# EAGLE design frontpanelboard (EAGLE 7.5.0)
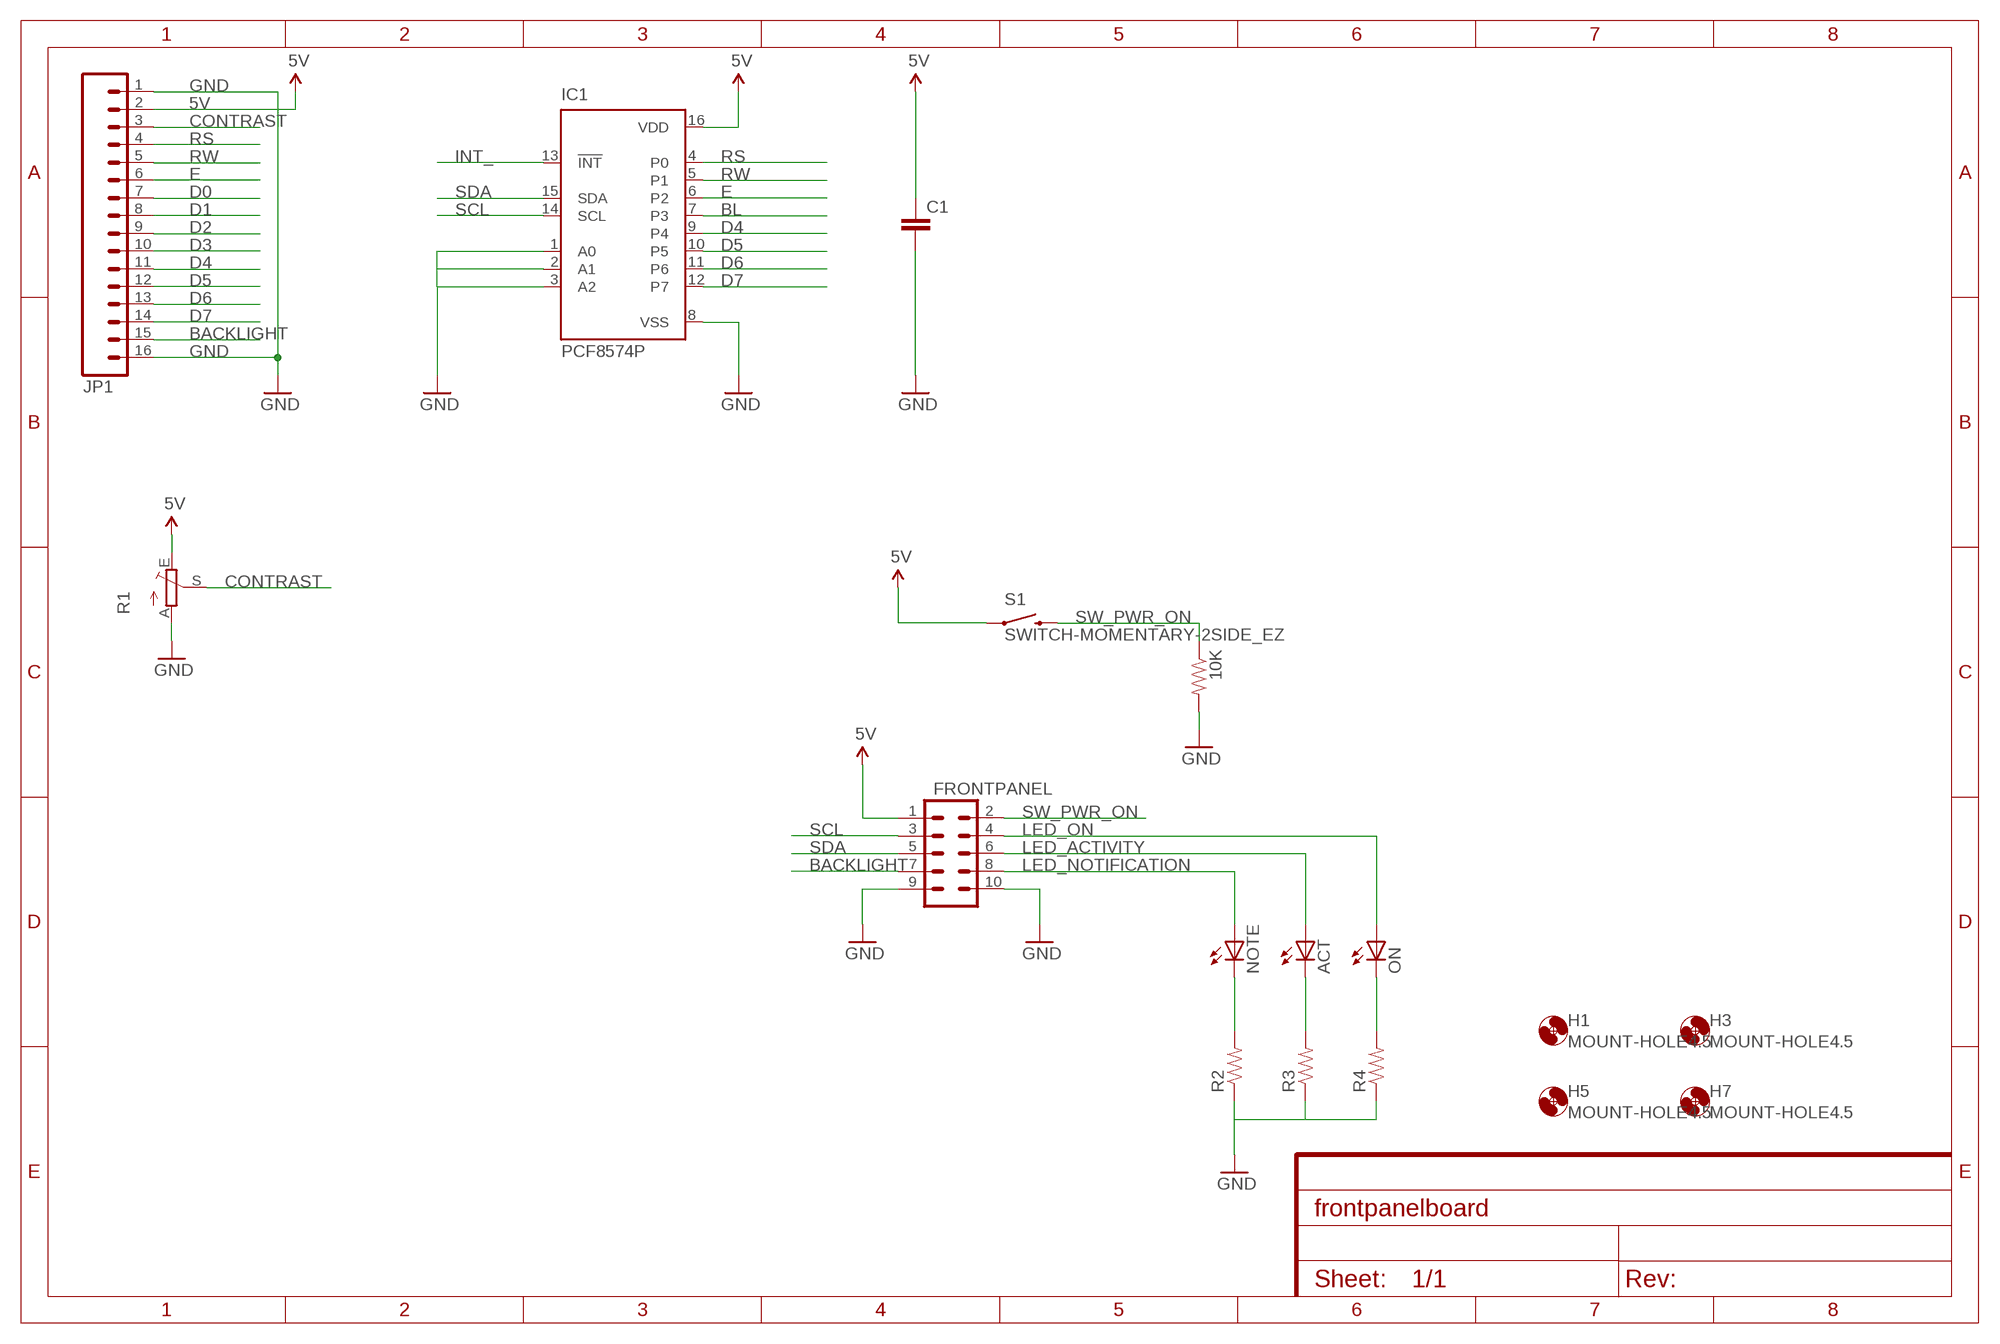
[diagram p0: schematic, sheet 1]

## Parts
10K  RESISTOREZ  [AXIAL-0.3EZ]
ACT  LEDB155  [Q62902-B155]
C1  CAPEZ  [CAP-PTH-SMALLEZ]
FRONTPANEL  M05X2SHD_LOCK  [2X5-SHROUDED_LOCK]
H1  MOUNT-HOLE4.5  [4,5]
H3  MOUNT-HOLE4.5  [4,5]
H5  MOUNT-HOLE4.5  [4,5]
H7  MOUNT-HOLE4.5  [4,5]
IC1  PCF8574P  [DIL16]
JP1  M16LONGPADS  [1X16_LONGPADS]
NOTE  LEDB155  [Q62902-B155]
ON  LEDB155  [Q62902-B155]
R1  TRIM_EU-LI10  [LI10]
R2  RESISTOREZ  [AXIAL-0.3EZ]
R3  RESISTOREZ  [AXIAL-0.3EZ]
R4  RESISTOREZ  [AXIAL-0.3EZ]
S1  SWITCH-MOMENTARY-2SIDE_EZ  [TACTILE-PTH-SIDEEZ]

## Nets
5V: C1.1 FRONTPANEL.1 IC1.16(VDD) JP1.2 R1.E S1.1
BACKLIGHT: FRONTPANEL.7 JP1.15
BL: IC1.7(P3)
CONTRAST: JP1.3 R1.S
D0: JP1.7
D1: JP1.8
D2: JP1.9
D3: JP1.10
D4: IC1.9(P4) JP1.11
D5: IC1.10(P5) JP1.12
D6: IC1.11(P6) JP1.13
D7: IC1.12(P7) JP1.14
E: IC1.6(P2) JP1.6
GND: 10K.P$2 C1.2 FRONTPANEL.9 FRONTPANEL.10 IC1.1(A0) IC1.2(A1) IC1.3(A2) IC1.8(VSS) JP1.1 JP1.16 R1.A R2.P$1 R3.P$1 R4.P$1
INT_: IC1.13(!INT)
LED_ACTIVITY: ACT.A FRONTPANEL.6
LED_NOTIFICATION: FRONTPANEL.8 NOTE.A
LED_ON: FRONTPANEL.4 ON.A
N$1: ON.K(C) R4.P$2
N$2: ACT.K(C) R3.P$2
N$3: NOTE.K(C) R2.P$2
RS: IC1.4(P0) JP1.4
RW: IC1.5(P1) JP1.5
SCL: FRONTPANEL.3 IC1.14(SCL)
SDA: FRONTPANEL.5 IC1.15(SDA)
SW_PWR_ON: 10K.P$1 FRONTPANEL.2 S1.2

## Library data of the parts
10K R2-R4 = SparkFun-Resistors:RESISTOR: Resistor Basic schematic elements and footprints for 0603, 1206, and PTH resistors.
ACT NOTE ON = led:LED: LED OSRAM: - CHIPLED LG R971, LG N971, LY N971, LG Q971, LY Q971, LO R971, LY R971 LH N974, LH R974 LS Q976, LO Q976, LY Q976 LO Q996 - Hyper CHIPLED LW Q18S LB Q993, LB Q99A, LB R99A - SideLED LS A670, LO A670, LY A670, LG A670, LP A670 LB A673, LV A673, LT A673, LW A673 LH A674 LY A675 LS A676, LA A676, LO A676, LY A676, LW A676 LS A679, LY A679, LG A679 - Hyper Micro SIDELED® LS Y876, LA Y876, LO Y876, LY Y876 LT Y87S - SmartLED LW L88C, LW L88S LB L89C, LB L89S, LG L890 LS L89K, LO L89K, LY L89K LS L896, LA L896, LO L896, LY L896 - TOPLED LS T670, LO T670, LY T670, LG T670, LP T670 LSG T670, LSP T670, LSY T670, LOP T670, LYG T670 LG T671, LOG T671, LSG T671 LB T673, LV T673, LT T673, LW T673 LH T674 LS T676, LA T676, LO T676, LY T676, LB T676, LH T676, LSB T676, LW T676 LB T67C, LV T67C, LT T67C, LS T67K, LO T67K, LY T67K, LW E67C LS E67B, LA E67B, LO E67B, LY E67B, LB E67C, LV E67C, LT E67C LW T67C LS T679, LY T679, LG T679 LS T770, LO T770, LY T770, LG T770, LP T770 LB T773, LV T773, LT T773, LW T773 LH T774 LS E675, LA E675, LY E675, LS T675 LS T776, LA T776, LO T776, LY T776, LB T776 LHGB T686 LT T68C, LB T68C - Hyper Mini TOPLED® LB M676 - Mini TOPLED Santana® LG M470 LS M47K, LO M47K, LY M47K Source: http://www.osram.convergy.de LUXEON: - LUMILED® LXK2-PW12-R00, LXK2-PW12-S00, LXK2-PW14-U00, LXK2-PW14-V00 LXK2-PM12-R00, LXK2-PM12-S00, LXK2-PM14-U00 LXK2-PE12-Q00, LXK2-PE12-R00, LXK2-PE12-S00, LXK2-PE14-T00, LXK2-PE14-U00 LXK2-PB12-K00, LXK2-PB12-L00, LXK2-PB12-M00, LXK2-PB14-N00, LXK2-PB14-P00, LXK2-PB14-Q00 LXK2-PR12-L00, LXK2-PR12-M00, LXK2-PR14-Q00, LXK2-PR14-R00 LXK2-PD12-Q00, LXK2-PD12-R00, LXK2-PD12-S00 LXK2-PH12-R00, LXK2-PH12-S00 LXK2-PL12-P00, LXK2-PL12-Q00, LXK2-PL12-R00 Source: www.luxeon.com KINGBRIGHT: KA-3528ASYC Source: www.kingbright.com
C1 = SparkFun-Capacitors:CAP: Capacitor Standard 0603 ceramic capacitor, and 0.1" leaded capacitor.
FRONTPANEL = SparkFun-Connectors:M05X2: Header 5x2 Standard 10-pin dual row 0.1" header. Commonly used with AVR-ISP. Use with Spark Fun Electronics SKU: PRT-00778
H1 H3 H5 H7 = holes:MOUNT-HOLE: MOUNTING HOLE with drill center marker
IC1 = micro-philips:PCF8574: I2C-Bus Remote 8-bit I/O expander http://www.semiconductors.philips.com/acrobat_download/datasheets/PCF8574_4.pdf; MPN: PCF8574PN; OC_FARNELL: 204020; OC_NEWARK: 11N8515
JP1 = SparkFun-Connectors:M16: 1x16 .1" header
R1 = pot:TRIM_EU-: POTENTIOMETER
S1 = SparkFun-Electromechanical:SWITCH-MOMENTARY-2: Various NO switches- pushbuttons, reed, etc

## Board
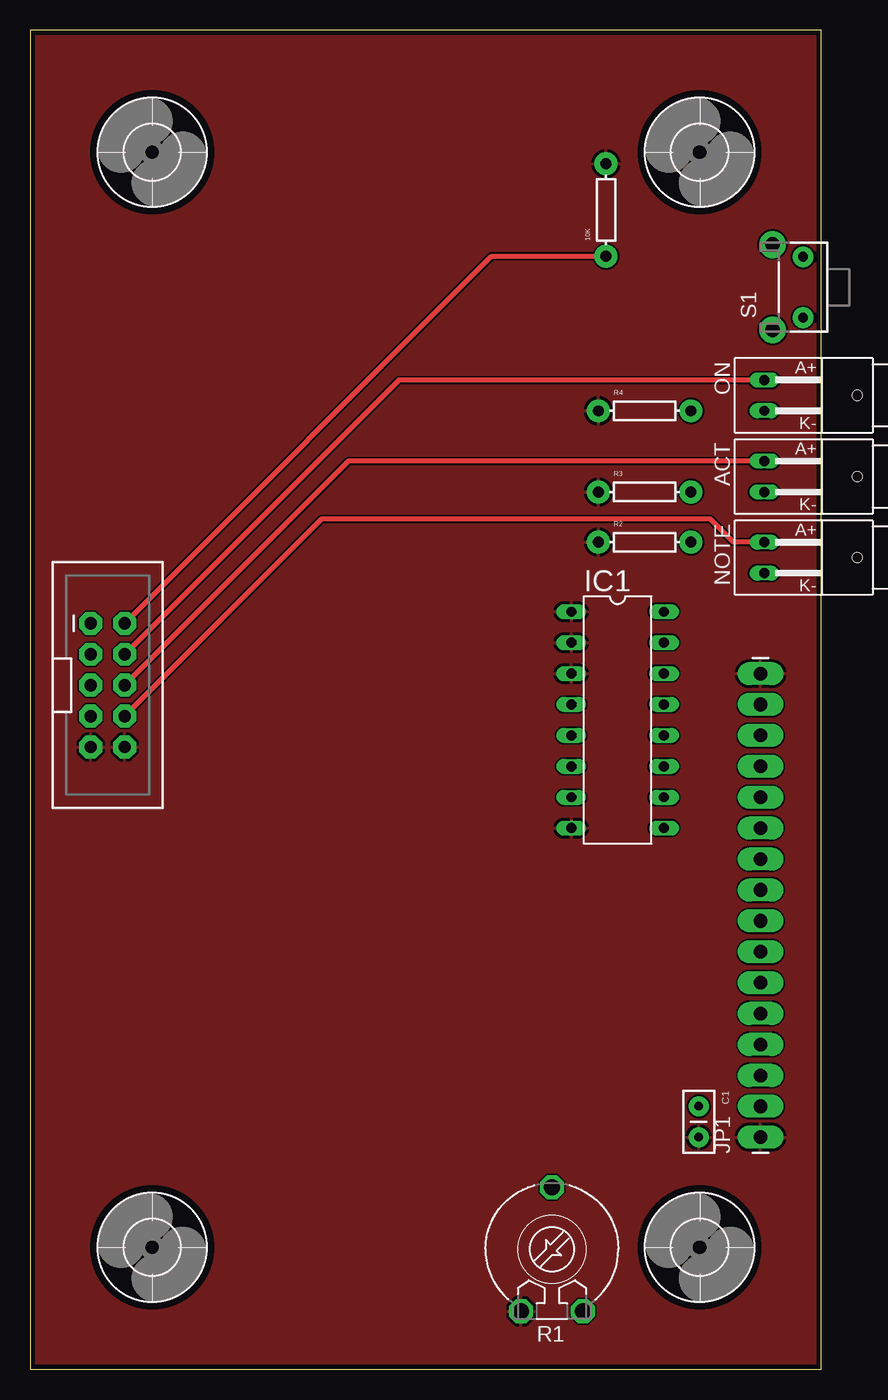
[diagram p1: board, top side]
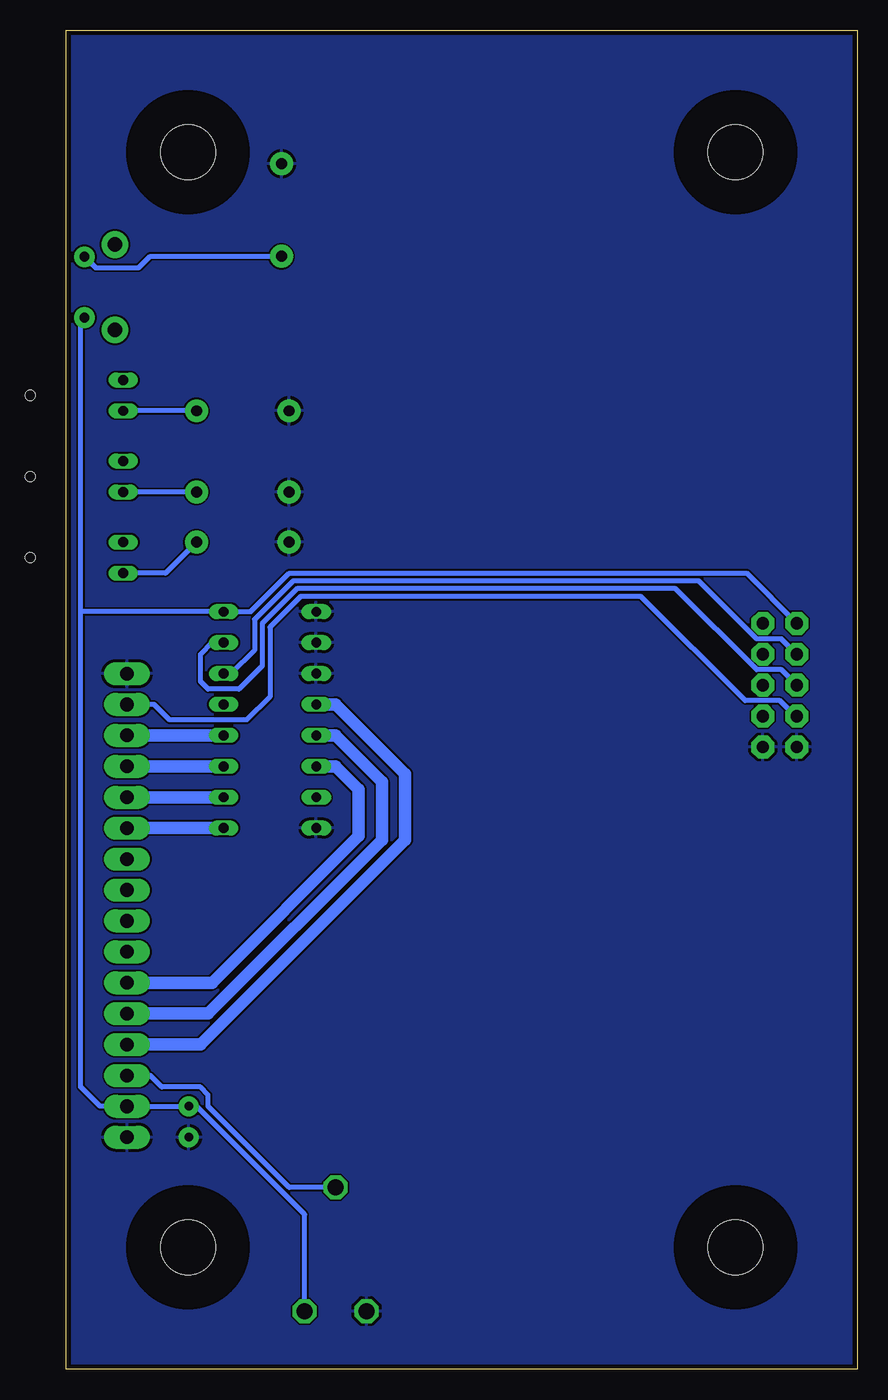
[diagram p2: board, bottom side, seen from below]

Size 65 x 110 mm. Coordinates in mm from the lower left corner, seen from the top.
Outline: 65,0 65,110 0,110 0,0 65,0
Copper layers (1*16): Top 0.0356mm / dielectric 1.5011mm / Bottom 0.0356mm
Design rules "LaenPCBOrder": minimum track width 6mil, minimum drill 13mil, track to track 6mil, track to pad 6mil, pad to pad 6mil, via to via 6mil, smd to smd 6mil, copper to edge 15mil, drill to drill 6mil, minimum pad ring 7mil, minimum via ring 7mil, stop-mask expansion 3mil, vias tented up to drill 0mil, thermal gap 10mil

### Footprints (pad centres in the part's own frame; a part is rotated, then mirrored left to right if it is on the bottom)
AXIAL-0.3EZ = drill 0.9 pad 1.88: P$1 -3.81,0; P$2 3.81,0
Q62902-B155 = drill 0.813 long: A 7.62,-1.27; K 7.62,1.27 | hole 0.813: 0,0
CAP-PTH-SMALLEZ = drill 0.7 pad 1.651: 1 0,0; 2 2.54,0
2X5-SHROUDED_LOCK = drill 1.016 pad 1.88 octagon: 1 -1.397,5.08; 2 1.397,5.08; 3 -1.397,2.54; 4 1.397,2.54; 5 -1.397,0; 6 1.397,0; 7 -1.397,-2.54; 8 1.397,-2.54; 9 -1.397,-5.08; 10 1.397,-5.08
4,5 = hole 4.5: 0,0
DIL16 = drill 0.813 long: 1 -8.89,-3.81; 2 -6.35,-3.81; 3 -3.81,-3.81; 4 -1.27,-3.81; 5 1.27,-3.81; 6 3.81,-3.81; 7 6.35,-3.81; 8 8.89,-3.81; 9 8.89,3.81; 10 6.35,3.81; 11 3.81,3.81; 12 1.27,3.81; 13 -1.27,3.81; 14 -3.81,3.81; 15 -6.35,3.81; 16 -8.89,3.81
1X16_LONGPADS = drill 1.118 pad 1.88 long: 1 0,0; 2 2.54,0; 3 5.08,0; 4 7.62,0; 5 10.16,0; 6 12.7,0; 7 15.24,0; 8 17.78,0; 9 20.32,0; 10 22.86,0; 11 25.4,0; 12 27.94,0; 13 30.48,0; 14 33.02,0; 15 35.56,0; 16 38.1,0
LI10 = drill 1.321 octagon: A -2.54,-5.08; E 2.54,-5.08; S 0,5.08
TACTILE-PTH-SIDEEZ = drill 0.8 pad 1.7: 1 -2.5,0; 2 2.5,0 | drill 1.2 pad 2.2: ANCHOR1 -3.5,2.5; ANCHOR2 3.5,2.5

### Placement (x,y rotation side)
10K  47.31,95.25 90 top
ACT  67.94,73.34 180 top
C1  54.93,21.59 270 top
FRONTPANEL  6.35,56.2 0 top
H1  55,10 90 top
H3  55,100 90 top
H5  10,10 90 top
H7  10,100 90 top
IC1  48.26,53.34 270 top
JP1  60.01,19.05 90 top
NOTE  67.94,66.67 180 top
ON  67.94,80.01 180 top
R1  42.86,9.84 0 top
R2  50.48,67.94 0 top
R3  50.48,72.07 0 top
R4  50.48,78.74 0 top
S1  63.5,88.9 90 top

### Tracks (layer width: path | path; a pad name or v marks a point on that pad's centre or on a via)
5V
  Bottom 0.406: FRONTPANEL.1 9.08,65.41 46.67,65.41 49.85,62.23 IC1.16 63.82,62.23 | 63.82,62.23 63.82,23.18 62.23,21.59 JP1.2 C1.1 54.29,21.59 45.4,12.7 R1.E | 63.82,62.23 63.82,86.04 63.5,86.36 S1.1
BACKLIGHT
  Bottom 0.406: FRONTPANEL.7 5.08,53.66 6.35,54.93 9.21,54.93 17.78,63.5 45.72,63.5 48.26,60.96 48.26,55.24 50.16,53.34 56.52,53.34 57.78,54.61 JP1.15
CONTRAST
  Bottom 0.406: R1.S 46.67,14.92 53.34,21.59 53.34,22.54 53.98,23.18 57.15,23.18 58.1,24.13 JP1.3
D4
  Bottom 1.016: IC1.9 JP1.11
D5
  Bottom 1.016: IC1.10 JP1.12
D6
  Bottom 1.016: IC1.11 JP1.13
D7
  Bottom 1.016: IC1.12 JP1.14
E
  Bottom 1.016: JP1.6 53.02,31.75 40.96,43.81 40.96,47.62 42.86,49.53 IC1.6
GND
  pour Bottom: 0,109.86 65,109.86 65,0 0,0
  pour Top: 0,109.86 65,109.86 65,0 0,0
LED_ACTIVITY
  Top 0.406: ACT.A 26.16,74.61 FRONTPANEL.6
LED_NOTIFICATION
  Top 0.406: NOTE.A 57.78,67.94 55.88,69.85 23.94,69.85 FRONTPANEL.8
LED_ON
  Top 0.406: ON.A 30.29,81.28 FRONTPANEL.4
N$1
  Bottom 0.406: R4.P$2 ON.K
N$2
  Bottom 0.406: R3.P$2 ACT.K
N$3
  Bottom 0.406: R2.P$2 56.83,65.41 NOTE.K
RS
  Bottom 1.016: JP1.4 53.98,26.67 37.15,43.5 37.15,48.9 42.86,54.61 IC1.4
RW
  Bottom 1.016: JP1.5 53.34,29.21 39.05,43.5 39.05,48.26 42.86,52.07 IC1.5
SCL
  Bottom 0.406: FRONTPANEL.3 6.22,60.01 8.26,60.01 13.02,64.77 46.35,64.77 49.53,61.59 49.53,59.05 51.44,57.15 IC1.14
SDA
  Bottom 0.406: FRONTPANEL.5 6.22,57.47 8.26,57.47 14.92,64.14 46.04,64.14 48.9,61.28 48.9,57.78 50.8,55.88 53.34,55.88 53.98,56.52 53.98,58.74 53.02,59.69 IC1.15
SW_PWR_ON
  Top 0.406: FRONTPANEL.2 37.91,91.44 10K.P$1
  Bottom 0.406: S1.2 62.59,90.49 59.05,90.49 58.1,91.44 10K.P$1

### Text on the board
tPlace: REAR